# EAGLE design actik-retrofit (EAGLE 9.5.0)
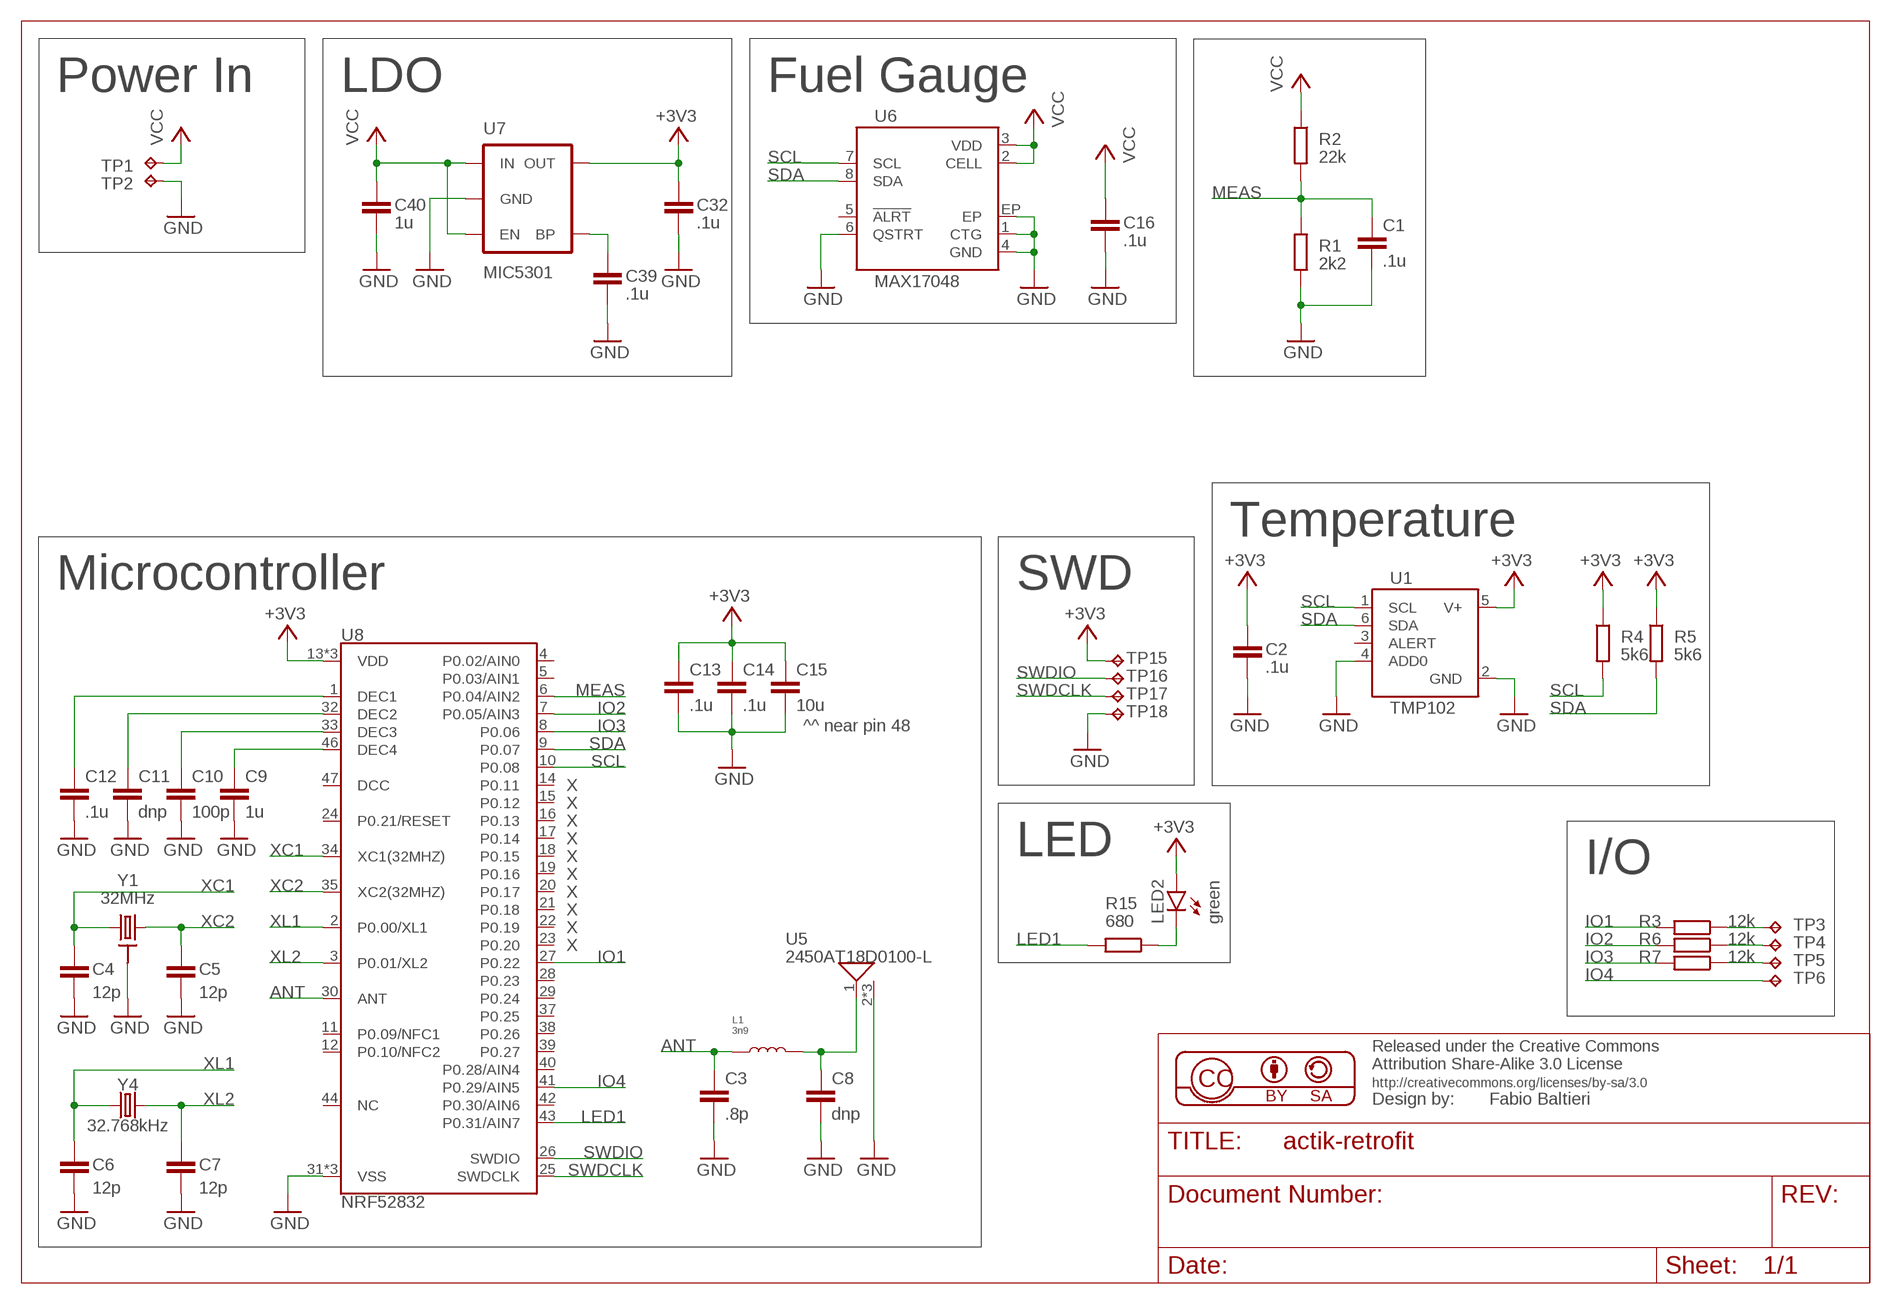
[diagram p0: schematic, sheet 1]

## Parts
C1  .1u  C0603  [0603]
C2  .1u  C0603  [0603]
C3  .8p  C0603  [0603]
C4  12p  C0603  [0603]
C5  12p  C0603  [0603]
C6  12p  C0603  [0603]
C7  12p  C0603  [0603]
C8  dnp  C0603  [0603]
C9  1u  C0603  [0603]
C10  100p  C0603  [0603]
C11  dnp  C0603  [0603]
C12  .1u  C0603  [0603]
C13  .1u  C0603  [0603]
C14  .1u  C0603  [0603]
C15  10u  C0603  [0603]
C16  .1u  C0603  [0603]
C32  .1u  C0603  [0603]
C39  .1u  C0603  [0603]
C40  1u  C0603  [0603]
L1  3n9  INDUCTOR_0603  [L0603]
LED2  green  LEDSML0805  [SML0805]
R1  2k2  R0603  [0603]
R2  22k  R0603  [0603]
R3  12k  R0603  [0603]
R4  5k6  R0603  [0603]
R5  5k6  R0603  [0603]
R6  12k  R0603  [0603]
R7  12k  R0603  [0603]
R15  680  R0603  [0603]
TP1  TPTP10R  [TP10R]
TP2  TPTP10R  [TP10R]
TP3  TPTP10R  [TP10R]
TP4  TPTP10R  [TP10R]
TP5  TPTP10R  [TP10R]
TP6  TPTP10R  [TP10R]
TP15  TPTP10R  [TP10R]
TP16  TPTP10R  [TP10R]
TP17  TPTP10R  [TP10R]
TP18  TPTP10R  [TP10R]
U1  TMP102  [SOT563]
U5  2450AT18D0100-L  [2450AT18D0100-L]
U6  MAX17048  [TDFN8L]
U7  MIC5301  V_REG_LDOSMD  [SOT23-5]
U8  NRF52832  [QFN48-6X6MM]
Y1  32MHz  XTAL-GND-2X1.6  [XTAL-2X1.6]
Y4  32.768kHz  CRYSTAL-32.768KHZSMD-3.2X1.5  [CRYSTAL-SMD-3.2X1.5MM]

## Nets
+3V3: C2.1 C13.1 C14.1 C15.1 C32.1 LED2.A R4.1 R5.1 TP15.TP U1.5(V+) U7.5(OUT) U8.13(VDD) U8.36(VDD) U8.48(VDD)
ANT: C3.1 L1.P$1 U8.30(ANT)
GND: C1.2 C2.2 C3.2 C4.2 C5.2 C6.2 C7.2 C8.2 C9.2 C10.2 C11.2 C12.2 C13.2 C14.2 C15.2 C16.2 C32.2 C39.2 C40.2 R1.2 TP2.TP TP18.TP U1.2(GND) U1.4(ADD0) U5.2(GND) U5.3(GND) U5.4(GND) U6.1(CTG) U6.4(GND) U6.6(QSTRT) U6.EP U7.2(GND) U8.31(VSS) U8.45(VSS) U8.EP(VSS) Y1.2(GND) Y1.4(GND)
IO1: R3.2 U8.27(P0.22)
IO2: R6.2 U8.7(P0.05/AIN3)
IO3: R7.2 U8.8(P0.06)
IO4: TP6.TP U8.41(P0.29/AIN5)
LED1: R15.2 U8.43(P0.31/AIN7)
MEAS: C1.1 R1.1 R2.2 U8.6(P0.04/AIN2)
N$1: C8.1 L1.P$2 U5.1(FEED)
N$2: C9.1 U8.46(DEC4)
N$3: C10.1 U8.33(DEC3)
N$4: C11.1 U8.32(DEC2)
N$5: C12.1 U8.1(DEC1)
N$6: R7.1 TP5.TP
N$10: R3.1 TP3.TP
N$15: R6.1 TP4.TP
N$23: LED2.C R15.1
N$30: C39.1 U7.4(BP)
SCL: R4.2 U1.1(SCL) U6.7(SCL) U8.10(P0.08)
SDA: R5.2 U1.6(SDA) U6.8(SDA) U8.9(P0.07)
SWDCLK: TP17.TP U8.25(SWDCLK)
SWDIO: TP16.TP U8.26(SWDIO)
VCC: C16.1 C40.1 R2.1 TP1.TP U6.2(CELL) U6.3(VDD) U7.1(IN) U7.3(EN)
XC1: C4.1 U8.34(XC1(32MHZ)) Y1.1
XC2: C5.1 U8.35(XC2(32MHZ)) Y1.3
XL1: C6.1 U8.2(P0.00/XL1) Y4.P$1
XL2: C7.1 U8.3(P0.01/XL2) Y4.P$2
Unconnected: U1.3(ALERT) U6.5(!ALRT) U8.4(P0.02/AIN0) U8.5(P0.03/AIN1) U8.11(P0.09/NFC1) U8.12(P0.10/NFC2) U8.14(P0.11) U8.15(P0.12) U8.16(P0.13) U8.17(P0.14) U8.18(P0.15) U8.19(P0.16) U8.20(P0.17) U8.21(P0.18) U8.22(P0.19) U8.23(P0.20) U8.24(P0.21/RESET) U8.28(P0.23) U8.29(P0.24) U8.37(P0.25) U8.38(P0.26) U8.39(P0.27) U8.40(P0.28/AIN4) U8.42(P0.30/AIN6) U8.44(NC) U8.47(DCC)

## Notes on the sheet
- Power In | LDO | Fuel Gauge
- Temperature
- Microcontroller | SWD
- ^^ near pin 48
- X
- X
- X
- X
- X | LED
- X | I/O
- X
- X
- X
- X

## Library data of the parts
C1-C16 C32 C39 C40 = balto:C: Capacitor
L1 = MF_Passives:INDUCTOR: Library: MF_Passives Description: Device for Inductors. Manufacture part number (MPN) can be added via Attributes. Check https://factory.macrofab.com/parts for the house parts list.; POPULATE: 1
LED2 = led:LED: LED OSRAM: - CHIPLED LG R971, LG N971, LY N971, LG Q971, LY Q971, LO R971, LY R971 LH N974, LH R974 LS Q976, LO Q976, LY Q976 LO Q996 - Hyper CHIPLED LW Q18S LB Q993, LB Q99A, LB R99A - SideLED LS A670, LO A670, LY A670, LG A670, LP A670 LB A673, LV A673, LT A673, LW A673 LH A674 LY A675 LS A676, LA A676, LO A676, LY A676, LW A676 LS A679, LY A679, LG A679 - Hyper Micro SIDELED® LS Y876, LA Y876, LO Y876, LY Y876 LT Y87S - SmartLED LW L88C, LW L88S LB L89C, LB L89S, LG L890 LS L89K, LO L89K, LY L89K LS L896, LA L896, LO L896, LY L896 - TOPLED LS T670, LO T670, LY T670, LG T670, LP T670 LSG T670, LSP T670, LSY T670, LOP T670, LYG T670 LG T671, LOG T671, LSG T671 LB T673, LV T673, LT T673, LW T673 LH T674 LS T676, LA T676, LO T676, LY T676, LB T676, LH T676, LSB T676, LW T676 LB T67C, LV T67C, LT T67C, LS T67K, LO T67K, LY T67K, LW E67C LS E67B, LA E67B, LO E67B, LY E67B, LB E67C, LV E67C, LT E67C LW T67C LS T679, LY T679, LG T679 LS T770, LO T770, LY T770, LG T770, LP T770 LB T773, LV T773, LT T773, LW T773 LH T774 LS E675, LA E675, LY E675, LS T675 LS T776, LA T776, LO T776, LY T776, LB T776 LHGB T686 LT T68C, LB T68C - Hyper Mini TOPLED® LB M676 - Mini TOPLED Santana® LG M470 LS M47K, LO M47K, LY M47K Source: http://www.osram.convergy.de LUXEON: - LUMILED® LXK2-PW12-R00, LXK2-PW12-S00, LXK2-PW14-U00, LXK2-PW14-V00 LXK2-PM12-R00, LXK2-PM12-S00, LXK2-PM14-U00 LXK2-PE12-Q00, LXK2-PE12-R00, LXK2-PE12-S00, LXK2-PE14-T00, LXK2-PE14-U00 LXK2-PB12-K00, LXK2-PB12-L00, LXK2-PB12-M00, LXK2-PB14-N00, LXK2-PB14-P00, LXK2-PB14-Q00 LXK2-PR12-L00, LXK2-PR12-M00, LXK2-PR14-Q00, LXK2-PR14-R00 LXK2-PD12-Q00, LXK2-PD12-R00, LXK2-PD12-S00 LXK2-PH12-R00, LXK2-PH12-S00 LXK2-PL12-P00, LXK2-PL12-Q00, LXK2-PL12-R00 Source: www.luxeon.com KINGBRIGHT: KA-3528ASYC Source: www.kingbright.com
R1-R7 R15 = balto:R: Resistor
TP1-TP6 TP15-TP18 = testpad:TP: Test pad
U1 = balto:TMP102: TMP102 Low-Power Digital Temperature SensorWith SMBusand Two-Wire Serial Interface in SOT563
U5 = balto:2450AT18D0100: 2.45 GHz SMD Antenna, EIA 1210, Detuning resilient, Edge Mount Design
U6 = balto:MAX17048: 3μA 1-Cell/2-Cell Fuel Gauge with ModelGauge
U7 = SparkFun-PowerIC:V_REG_LDO: Voltage Regulator LDO Standard 150mA LDO voltage regulator in SOT-23 layout. Micrel part MIC5205. BP (by-pass) pin is used to lower output noise with 470pF cap.
U8 = SparkFun-RF:NRF52832: Nordic nRF52832 Bluetooth Smart/ANT/2.4GHz RF SoC The nRF52832 SoC is a powerful, highly flexible ultra-low power multiprotocol SoC ideally suited for Bluetooth® Smart ANT and 2.4GHz ultra low-power wireless applications. The nRF52832 SoC is built around a 32-bit ARM® Cortex™-M4F CPU with 512kB + 64kB RAM. The embedded 2.4GHz transceiver supports Bluetooth Smart, ANT and proprietary 2.4 GHz protocol stack. It is on air compatible with the nRF51 Series, nRF24L and nRF24AP Series products from Nordic Semiconductor. Datasheet <https://cdn.sparkfun.com/datasheets/Wireless/Bluetooth/nRF52832_PS_v1.0.pdf> SparkFun Products: SparkFun nRF52832 Breakout <https://www.sparkfun.com/products/13990>; PROD_ID: IC-13460
Y1 = balto:XTAL-GND: Crystal Oscillator with GND
Y4 = SparkFun-Clocks:CRYSTAL-32.768KHZ: 32.768kHz Crystal Frequency: 32.768kHz Frequency Stability: ±20ppm Load Capacitance: 12.5pF (PTH-2X6 & SMD-3.2X1.5), 6pF (SMD-2X6) SparkFun Products: SparkFun BigTime Watch Kit <https://www.sparkfun.com/products/11734> SparkFun nRF52832 Breakout <https://www.sparkfun.com/products/13990> SparkFun Real Time Clock Module <https://www.sparkfun.com/products/12708>; PROD_ID: XTAL-13062

## Board
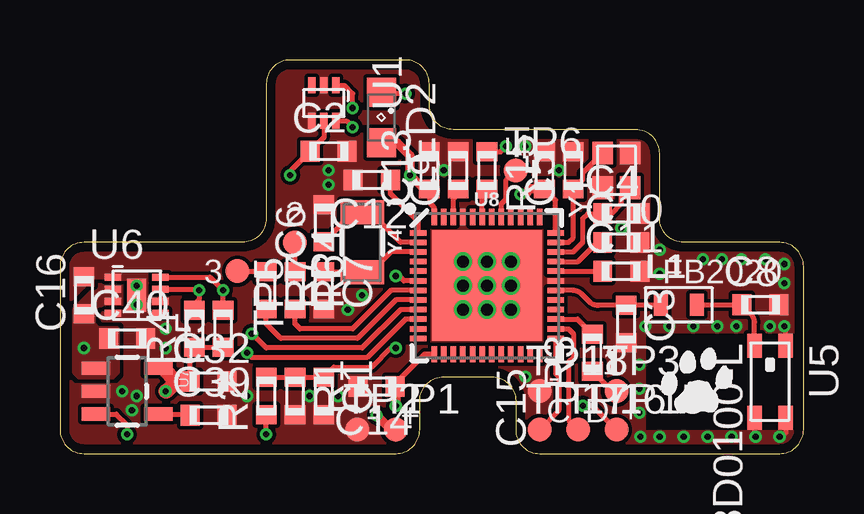
[diagram p1: board, top side]
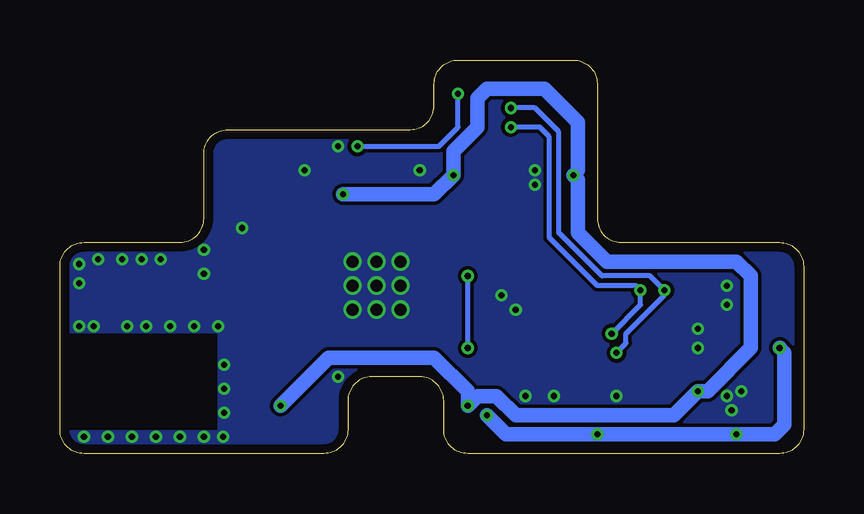
[diagram p2: board, bottom side, seen from below]

Size 31 x 16.4 mm. Coordinates in mm from the lower left corner, seen from the top.
Outline: 31,1 31,7.8 arc90 30,8.8 26,8.8 arc-90 25,9.8 25,12.5 arc90 24,13.5 16.4,13.5 arc-90 15.4,14.5 15.4,15.4 arc90 14.4,16.4 9.6,16.4 arc90 8.6,15.4 8.6,9.8 arc-90 7.6,8.8 1,8.8 arc90 0,7.8 0,1 arc90 1,0 14,0 arc90 15,1 15,2.2 arc-90 16,3.2 18,3.2 arc-90 19,2.2 19,1 arc90 20,0 30,0 arc90 31,1
Copper layers (1*16): Top 0.035mm / dielectric 1.5mm / Bottom 0.035mm
Design rules "balto *": minimum track width 6mil, minimum drill 10mil, track to track 6mil, track to pad 6mil, pad to pad 6mil, via to via 6mil, smd to smd 6mil, copper to edge 15mil, drill to drill 5mil, minimum pad ring 5mil, minimum via ring 5mil, stop-mask expansion 2mil, vias tented up to drill 20mil, thermal gap 8mil

### Footprints (pad centres in the part's own frame; a part is rotated, then mirrored left to right if it is on the bottom)
0603 = smd 0.787 x 0.864: 1 -0.774,0; 2 0.774,0
L0603 = smd 0.6 x 0.9: P$1 -0.75,0; P$2 0.75,0
SML0805 = smd 1.2 x 1.2: A 1.05,0; C -1.05,0
TP10R = smd 1 x 1: TP 0,0
SOT563 = smd 0.67 x 0.3: 1 -0.74,0.5; 2 -0.74,0; 3 -0.74,-0.5; 4 0.74,-0.5; 5 0.74,0; 6 0.74,0.5
2450AT18D0100-L = smd 1 x 0.6: 1 -1.5,-0.65; 2 1.5,-0.65; 3 1.5,0.65; 4 -1.5,0.65
TDFN8L = smd 0.7 x 0.3: 1 -0.99,0.75; 2 -0.99,0.25; 3 -0.99,-0.25; 4 -0.99,-0.75; 5 0.99,-0.75; 6 0.99,-0.25; 7 0.99,0.25; 8 0.99,0.75 | smd 0.8 x 1.38: EP 0,0
SOT23-5 = smd 0.55 x 1.2: 1 -0.95,-1.3; 2 0,-1.3; 3 0.95,-1.3; 4 0.95,1.3; 5 -0.95,1.3
QFN48-6X6MM = smd 0.68 x 0.23: 1 -2.86,2.2; 2 -2.86,1.8; 3 -2.86,1.4; 4 -2.86,1; 5 -2.86,0.6; 6 -2.86,0.2; 7 -2.86,-0.2; 8 -2.86,-0.6; 9 -2.86,-1; 10 -2.86,-1.4; 11 -2.86,-1.8; 12 -2.86,-2.2; 25 2.86,-2.2; 26 2.86,-1.8; 27 2.86,-1.4; 28 2.86,-1; 29 2.86,-0.6; 30 2.86,-0.2; 31 2.86,0.2; 32 2.86,0.6; 33 2.86,1; 34 2.86,1.4; 35 2.86,1.8; 36 2.86,2.2 | smd 0.23 x 0.68: 13 -2.2,-2.86; 14 -1.8,-2.86; 15 -1.4,-2.86; 16 -1,-2.86; 17 -0.6,-2.86; 18 -0.2,-2.86; 19 0.2,-2.86; 20 0.6,-2.86; 21 1,-2.86; 22 1.4,-2.86; 23 1.8,-2.86; 24 2.2,-2.86; 37 2.2,2.86; 38 1.8,2.86; 39 1.4,2.86; 40 1,2.86; 41 0.6,2.86; 42 0.2,2.86; 43 -0.2,2.86; 44 -0.6,2.86; 45 -1,2.86; 46 -1.4,2.86; 47 -1.8,2.86; 48 -2.2,2.86 | smd 4.6 x 4.6: EP 0,0
XTAL-2X1.6 = smd 0.95 x 0.85: 1 -0.725,-0.575; 2 0.725,-0.575; 3 0.725,0.575; 4 -0.725,0.575
CRYSTAL-SMD-3.2X1.5MM = smd 1 x 1.8: P$1 -1.25,0; P$2 1.25,0

### Placement (x,y rotation side)
C1  11,2.4 270 top
C2  11.2,12.6 0 top
C3  23.6,5.4 270 top
C4  23.4,10 0 top
C5  21.4,11.8 90 top
C6  11,9.6 90 top
C7  11,6.8 270 top
C8  29.2,6.2 0 top
C9  16.6,11.8 90 top
C10  23.4,8.8 0 top
C11  23.4,7.6 0 top
C12  13,11.4 180 top
C13  15.4,11.8 90 top
C14  13.2,2.8 180 top
C15  20.2,11.8 90 top
C16  1,6.6 90 top
C32  6.2,3 0 top
C39  6.2,1.6 0 top
C40  2.8,4.8 0 top
L1  25.8,6.2 0 top
LED2  13.4,14 270 top
R1  9.8,2.4 270 top
R2  8.6,2.4 90 top
R3  22.2,4.2 90 top
R4  5.6,5.2 90 top
R5  6.8,5.2 90 top
R6  9.8,6.8 270 top
R7  8.6,6.8 270 top
R15  17.8,11.8 270 top
TP1  14,1 0 top
TP2  12.4,1 0 top
TP3  23.2,2.6 0 top
TP4  9.8,8.8 270 top
TP5  7.4,7.6 270 top
TP6  19,11.8 0 top
TP15  23.2,1 0 top
TP16  21.6,1 0 top
TP17  20,1 0 top
TP18  20,2.6 0 top
U1  11,14.6 270 top
U5  29.6,3 270 top
U6  3.2,6.6 0 top
U7  2.8,2.6 270 top
U8  17.8,7 0 top
U$1  [CAT-L]  26.6,2.6 0 top
Y1  23.2,11.8 90 top
Y4  12.6,8.8 270 top

### Tracks (layer width: path | path; a pad name or v marks a point on that pad's centre or on a via)
+3V3  (via drill 0.25)
  Top 0.2: C13.1 15.4,10.46 15.6,10.26 U8.48 | U8.36 20.66,10.57 C15.1 | TP15.TP 22.2,2 v21.8,2 | C14.1 13.97,2.91 15.2,4.14 U8.13 | R5.1 R4.1 5.43,4.25 C32.1 | U1.5 11,13.18 C2.1 9.6,11.77 v9.6,11.6
  Top 0.4: U7.5 4.3,3.55 | C14.1 14,2.77 v14,2 | v19.2,10.8 19.23,10.82 19.4,10.82 19.6,11.03 C15.1 | C13.1 15.18,11.03 v14.6,11.6 14.6,12.4 14.05,12.95 LED2.A
  Top 0.6: 4.3,3.55 4.85,3 | 4.85,3 C32.1 | 4.85,3 4.45,2.6 v4.4,2.6
  Bottom 0.6: v21.8,2 19.8,4 15.4,4 14,2.6 v14,2 13.6,2.4 12.8,2.4 12,1.6 5.4,1.6 v4.4,2.6 4,2.6 2.2,4.4 2.2,7.4 2.8,8 8.2,8 9.4,9.2 9.4,11.4 v9.6,11.6 9.4,11.8 9.4,13.8 10.8,15.2 13.2,15.2 13.6,14.8 13.6,13.6 14.6,12.6 v14.6,11.6 15.4,10.8 v19.2,10.8
ANT
  Top 0.2: U8.30 21.39,6.8 arc-45 21.75,6.65 22.08,6.32 arc45 22.43,6.17 C3.1 23.62,6.2 L1.P$1
GND  (via drill 0.25, 0.51)
  Top 0.2: U5.4 30.25,5.32 | U5.2 28.95,0.85 | U5.3 30.25,0.85
  other vias: 23.4,9.4 20.8,11.8 19.4,3.2 12,6 3,1.8 3.2,6.2 3.2,7 17.8,7 17.8,8 16.8,8 16.8,7 16.8,6 17.8,6 18.8,6 18.8,7 18.8,8 30,0.7 29,0.7 28,0.7 27,0.7 26,0.7 25,0.7 24.2,0.7 24.15,1.7 24.4,5.3 25.4,5.3 26.4,5.3 27.4,5.3 28.2,5.3 29.6,5.3 30.2,5.3 24.15,3.7 24.15,2.7 30.2,7.1 30.2,7.9 29.4,8.1 28.4,8.1 27.6,8.1 26.8,8.1 25,8.5 25,7.5 19.4,12.8 16,11.8 11.2,11.2 11.2,11.8 12.6,6.6 4.4,4.4 4.4,5.2 7.8,2.4 10.4,2.4 2.6,2.6 3.2,2.4 11.6,2.4
  pour Top (rank 2, no thermals): -1,-1 32,-1 32,18 -1,18
  pour Bottom (no thermals): -2,-2 33,-2 33,19 -2,19
IO1
  Top 0.2: U8.27 21.57,5.6 R3.2
IO2
  Top 0.2: U8.7 13.8,6.8 12.2,5.2 10,5.2 9.8,5.4 R6.2
IO3
  Top 0.2: U8.8 14,6.4 12.4,4.8 9.2,4.8 8.6,5.4 R7.2
IO4
  Top 0.2: U8.41 18.4,10.4 18.6,10.6 18.6,11.4 TP6.TP
LED1
  Top 0.2: U8.43 17.6,10.63 17.8,10.82 R15.2
MEAS  (via drill 0.25)
  Top 0.2: R2.2 R1.1 C1.1 11.43,3.6 13,3.6 13.8,4.4 v14,4.4 | U8.6 14.34,7.2 14.14,7.4 v14,7.4
  Bottom 0.2: v14,4.4 v14,7.4
N$1
  Top 0.2: L1.P$2 C8.1 28.8,5.82 arc-45 28.95,5.47 U5.1
N$2
  Top 0.2: U8.46 16.4,10.63 16.6,10.82 C9.1
N$3
  Top 0.2: U8.33 21.6,8 22.4,8.8 C10.1
N$4
  Top 0.2: U8.32 C11.1
N$5
  Top 0.2: C12.1 13.77,10.82 14.94,9.66 U8.1
N$6
  Top 0.2: TP5.TP 8.57,7.6 R7.1
N$10
  Top 0.2: R3.1 23.03,2.6 TP3.TP
N$15
  Top 0.2: R6.1 TP4.TP
N$23  (via drill 0.25)
  Top 0.2: R15.1 18.38,12.57 v18.6,12.8 | v14.4,15 13.45,15 LED2.C
  Bottom 0.2: v18.6,12.8 15.2,12.8 14.4,13.6 v14.4,15
N$30
  Top 0.2: U7.4 5.38,1.65 C39.1
SCL  (via drill 0.25)
  Top 0.2: U6.7 5.75,6.85 v5.8,6.8 5.8,6.4 5.6,6.2 R4.2 | U8.10 14.4,5.6 12.8,4 8,4 v7.8,4.2 | v12.2,14.4 12.2,15 11.86,15.34 U1.1
  Bottom 0.2: v7.8,4.2 7.4,4.6 7.4,5 5.8,6.6 v5.8,6.8 6.4,7.4 8.4,7.4 10.2,9.2 10.2,13.4 11.2,14.4 v12.2,14.4
SDA  (via drill 0.25)
  Top 0.2: U6.8 6.25,7.35 v6.8,6.8 R5.2 | U8.9 14.2,6 12.6,4.4 8.6,4.4 v8,5 | U1.6 11.94,13.86 v12.2,13.6
  Bottom 0.2: v8,5 6.8,6.2 v6.8,6.8 7,7 8.6,7 10.6,9 10.6,13.2 11,13.6 v12.2,13.6
SWDCLK
  Top 0.2: U8.25 20.66,3.34 20.8,3.2 20.8,1.8 TP17.TP
SWDIO
  Top 0.2: U8.26 21.2,5.2 21.4,5 21.4,4 21.2,3.8 21.2,1.4 TP16.TP
VCC  (via drill 0.25)
  Top 0.2: U7.3 2.35,1.65 2.8,1.2 v2.8,0.8 | v8.6,0.8 R2.1
  Top 0.4: TP1.TP 13.8,1 v13.2,1.6
  Bottom 0.6: v13.2,1.6 12.4,0.8 v8.6,0.8 v2.8,0.8 1.2,0.8 0.8,1.2 0.8,4.2 v1,4.4
  pour Top (no thermals): 2.2,3.2 2.4,3.4 2.4,5.2 1.6,5.2 1.4,5.4 1.4,6 1.6,6.2 2.6,6.2 2.6,7 1.6,7 0.6,6 0.6,3.4 0.8,3.2
XC1
  Top 0.2: U8.34 21.4,8.4 21.8,8.8 21.8,9.8 22,10 C4.1 23,10 23.4,10.4 23.4,10.7 Y1.1
XC2
  Top 0.2: U8.35 21.2,8.8 21.4,9 C5.1 21.8,11.43 21.8,11.7 Y1.3
XL1
  Top 0.2: C6.1 12.22,10.05 Y4.P$1 12.95,10.05 14.2,8.8 U8.2
XL2
  Top 0.2: C7.1 12.57,7.57 Y4.P$2 12.95,7.55 13.8,8.4 U8.3

### Text on the board
_tsilk: 4 | 2 | 3 | FB2020 | 1 | - | - | + | C | D | +